# Altium schematic sheet CPLD.SchDoc
size A4
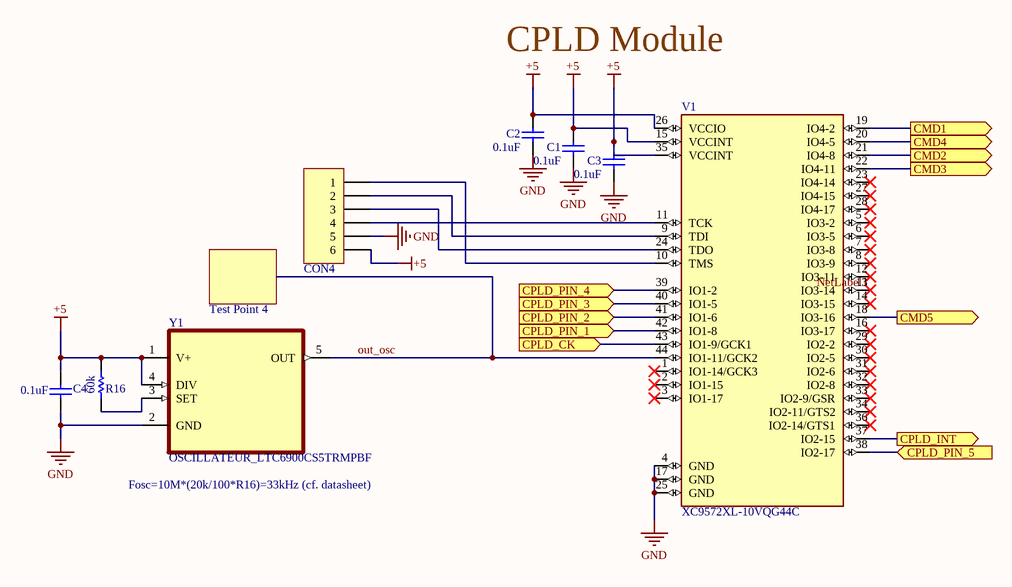
[diagram p0: CPLD.SchDoc]

## Parts
C1  value 0.1uF  [C0805]  (hidden comment: Cap_0.1u)
C2  value 0.1uF  [C0805]  (hidden comment: Cap_0.1u)
C3  value 0.1uF  [C0805]  (hidden comment: Cap_0.1u)
C4  value 0.1uF  [C0805]  (hidden comment: Cap_0.1u)
CON4  Header 6  [HDR1X6]  (value not drawn)
R16  Res_60k  [C0805]  (value not drawn)
Test_Point_4  Header_1  [PIN1]  (value not drawn)
V1  XC9572XL-10VQG44C  [VQFP-44_CPLD]
Y1  OSCILLATEUR_LTC6900CS5TRMPBF  [SOT95P280X100-5N_OSC]

## Ports
CMD1 (out), CMD2 (out), CMD3 (out), CMD4 (out), CMD5 (out), CPLD_CK (in), CPLD_INT (out), CPLD_PIN_1 (in), CPLD_PIN_2 (in), CPLD_PIN_3 (in), CPLD_PIN_4 (in), CPLD_PIN_5 (in)

## Nets
+5: C1.2 C2.2 C3.2 C4.2 CON4.6 R16.2 V1.15(VCCINT) V1.26(VCCIO) V1.35(VCCINT) Y1.1(V+) Y1.4(DIV)
GND: C1.1 C2.1 C3.1 C4.1 CON4.5 V1.4(GND) V1.17(GND) V1.25(GND) Y1.2(GND)
CMD1: V1.19(IO4-2) ; port CMD1
CMD2: V1.21(IO4-8) ; port CMD2
CMD3: V1.22(IO4-11) ; port CMD3
CMD4: V1.20(IO4-5) ; port CMD4
CMD5: V1.18(IO3-16) ; port CMD5
CPLD_CK: V1.43(IO1-9/GCK1) ; port CPLD_CK
CPLD_INT: V1.37(IO2-15) ; port CPLD_INT
CPLD_PIN_1: V1.42(IO1-8) ; port CPLD_PIN_1
CPLD_PIN_2: V1.41(IO1-6) ; port CPLD_PIN_2
CPLD_PIN_3: V1.40(IO1-5) ; port CPLD_PIN_3
CPLD_PIN_4: V1.39(IO1-2) ; port CPLD_PIN_4
CPLD_PIN_5: V1.38(IO2-17) ; port CPLD_PIN_5
out_osc: Test_Point_4.1 V1.44(IO1-11/GCK2) Y1.5(OUT)
NetCON4_1: CON4.1 V1.10(TMS)
NetCON4_2: CON4.2 V1.9(TDI)
NetCON4_3: CON4.3 V1.24(TDO)
NetCON4_4: CON4.4 V1.11(TCK)
NetR16_1: R16.1 Y1.3(SET)

Not connected (* = marked no-connect by the designer): V1 1(IO1-14/GCK3)* 2(IO1-15)* 3(IO1-17)* 5(IO3-2)* 6(IO3-5)* 7(IO3-8)* 8(IO3-9)* 12(IO3-11)* 13(IO3-14)* 14(IO3-15)* 16(IO3-17)* 23(IO4-14)* 27(IO4-15)* 28(IO4-17)* 29(IO2-2)* 30(IO2-5)* 31(IO2-6)* 32(IO2-8)* 33(IO2-9/GSR)* 34(IO2-11/GTS2)* 36(IO2-14/GTS1)*

## Notes on the sheet
- CPLD Module
- Fosc=10M*(20k/100*R16)=33kHz (cf. datasheet)
- Labels drawn without touching a wire or pin: NetLabel1
- Title
- Size:
- Date:
- Battery Management System
- A4
- Number:
- Time:
- 1
- Revision:
- Author: GEI Corp
- V1.0
- GEI Corp
- 135 avenue de Rangueil
- INSA Toulouse
- 31400 Toulouse
- FRANCE
- File:
- Projet_Inter_1\BMS_GEI_CORP
- (in symbol Res_60k) 60k

## Library data of the parts
C1-C4 = Cap_0.1u: Capacitor; Published: 8-Jun-2000; LatestRevisionDate: 17-Jul-2002; LatestRevisionNote: Re-released for DXP Platform.; PackageReference: RAD-0.3; Publisher: Altium Limited; PackageDescription: Radial Cap, Thru-Hole; 2 Leads; 0.3 in Pin Spacing
CON4 = Header 6: Header, 6-Pin; LatestRevisionDate: 17-Jul-2002; LatestRevisionNote: Re-released for DXP Platform.; Publisher: Altium Limited
R16 = Res_60k: Resistor
Test_Point_4 = Header_1: Header 1-pin
V1 = XC9572XL-10VQG44C: IC CPLD 72MC 10NS 44VQFP; MF: Xilinx Inc.; Value: *; MP: XC9572XL-10VQG44C; Package: VQFP-44 Xilinx; Availability: Warning; SnapEDA_Link: https://www.snapeda.com/parts/XC9572XL-10VQG44C/Xilinx%20Inc./view-part/51416/?ref=snap; Price: None; Purchase-URL: https://pricing.snapeda.com/search/part/XC9572XL-10VQG44C/?ref=eda; Check_prices: https://www.snapeda.com/parts/XC9572XL-10VQG44C/Xilinx%20Inc./view-part/51416/?ref=eda
Y1 = OSCILLATEUR_LTC6900CS5TRMPBF: Low Power, 1kHz to 20MHz Resistor Set SOT-23 Oscillator; Package: None; Price: None; Value: *; MP: LTC6900CS5TRMPBF; Availability: Unavailable